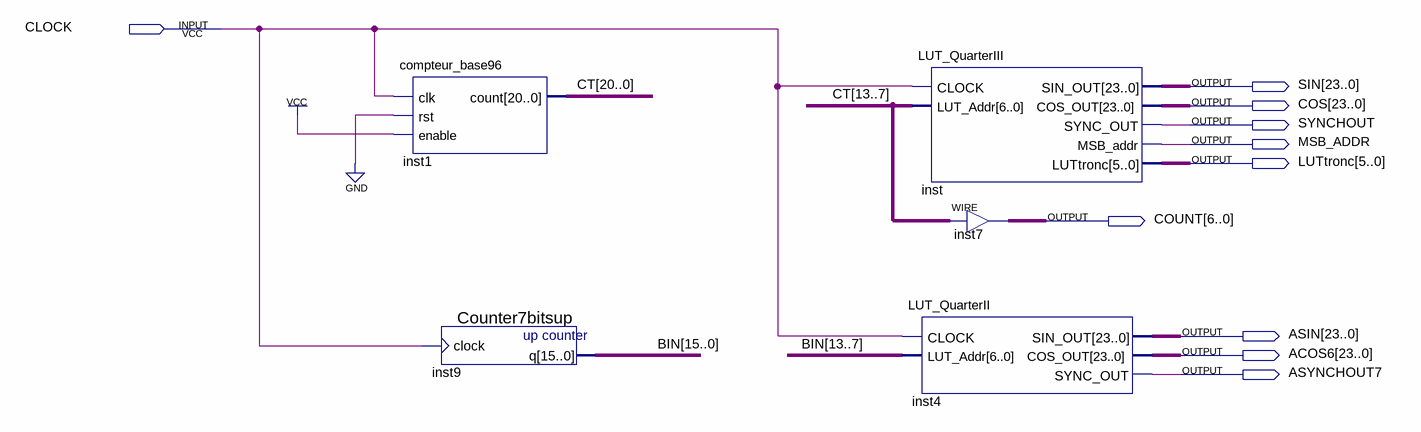
[diagram p0: schematic sheet]
// Quartus schematic TestLUTcount96.bdf as structural Verilog: 5 symbols, 10 pins
module TestLUTcount96 (
  input  CLOCK,
  output [23:0] SIN,
  output [23:0] COS,
  output SYNCHOUT,
  output MSB_ADDR,
  output [5:0] LUTtronc,
  output [6:0] COUNT,
  output [23:0] ASIN,
  output [23:0] ACOS6,
  output ASYNCHOUT7
);

  wire [15:0] BIN;
  wire [20:0] CT;

  compteur_base96 inst1 (.clk(CLOCK), .rst(1'b0), .enable(1'b1), .count(CT));
  Counter7bitsup inst9 (.clock(CLOCK), .q(BIN));
  LUT_QuarterIII inst (
    .CLOCK(CLOCK), .LUT_Addr(CT[13:7]), .SIN_OUT(SIN), .COS_OUT(COS), .SYNC_OUT(SYNCHOUT),
    .MSB_addr(MSB_ADDR), .LUTtronc(LUTtronc));
  assign COUNT = CT[13:7];  // WIRE inst7
  LUT_QuarterII inst4 (.CLOCK(CLOCK), .LUT_Addr(BIN[13:7]), .SIN_OUT(ASIN), .COS_OUT(ACOS6), .SYNC_OUT(ASYNCHOUT7));
endmodule
